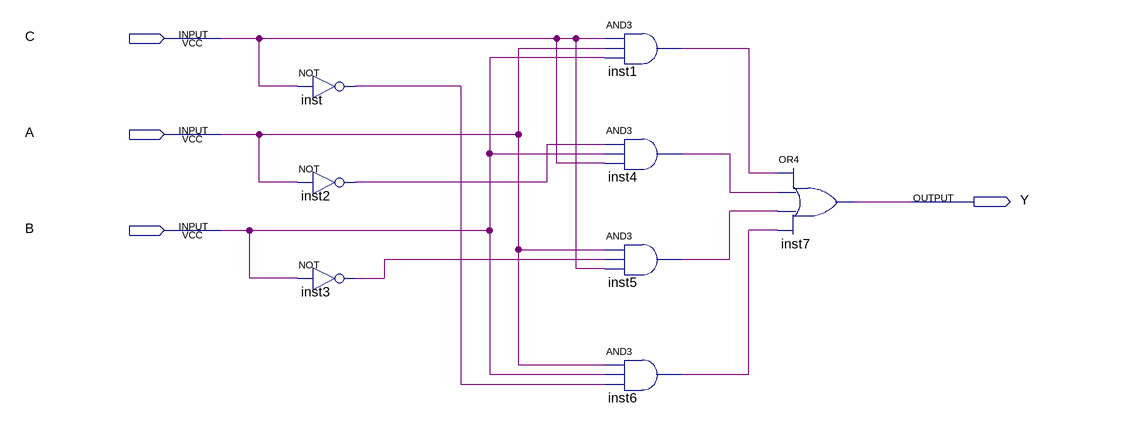
[diagram p0: schematic sheet]
// Quartus schematic Block3.bdf as structural Verilog: 8 symbols, 4 pins
module Block3 (
  input  C,
  input  A,
  input  B,
  output Y
);

  wire inst1_out, inst2_out, inst3_out, inst4_out, inst5_out, inst6_out, inst_out;

  not inst (inst_out, C);
  not inst2 (inst2_out, A);
  not inst3 (inst3_out, B);
  and inst1 (inst1_out, C, A, B);
  and inst4 (inst4_out, inst2_out, B, C);
  and inst5 (inst5_out, A, inst3_out, C);
  and inst6 (inst6_out, A, B, inst_out);
  or inst7 (Y, inst1_out, inst4_out, inst5_out, inst6_out);
endmodule
